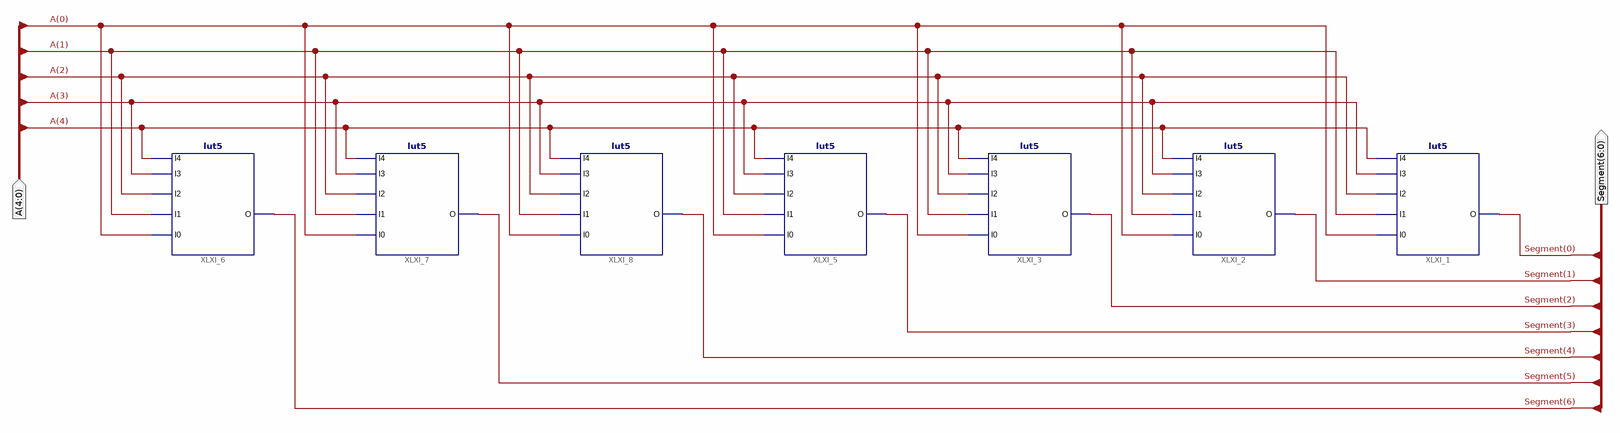
[diagram p0: schematic sheet 1]
// Xilinx ISE schematic ssd1daztb.sch (spartan6) as structural Verilog: 7 symbols, 2 ports
module ssd1daztb (
  input  [4:0] A,
  output [6:0] Segment
);

  lut5 #(.INIT("038D84FB")) XLXI_6 (.I0(A[0]), .I1(A[1]), .I2(A[2]), .I3(A[3]), .O(Segment[6]), .I4(A[4]));
  lut5 #(.INIT("015FECF7")) XLXI_7 (.I0(A[0]), .I1(A[1]), .I2(A[2]), .I3(A[3]), .O(Segment[5]), .I4(A[4]));
  lut5 #(.INIT("023AFCBF")) XLXI_8 (.I0(A[0]), .I1(A[1]), .I2(A[2]), .I3(A[3]), .O(Segment[4]), .I4(A[4]));
  lut5 #(.INIT("01B573CB")) XLXI_3 (.I0(A[0]), .I1(A[1]), .I2(A[2]), .I3(A[3]), .O(Segment[2]), .I4(A[4]));
  lut5 #(.INIT("03D1E3C9")) XLXI_2 (.I0(A[0]), .I1(A[1]), .I2(A[2]), .I3(A[3]), .O(Segment[1]), .I4(A[4]));
  lut5 #(.INIT("0207F075")) XLXI_1 (.I0(A[0]), .I1(A[1]), .I2(A[2]), .I3(A[3]), .O(Segment[0]), .I4(A[4]));
  lut5 #(.INIT("037C4A5E")) XLXI_5 (.I0(A[0]), .I1(A[1]), .I2(A[2]), .I3(A[3]), .O(Segment[3]), .I4(A[4]));
endmodule
